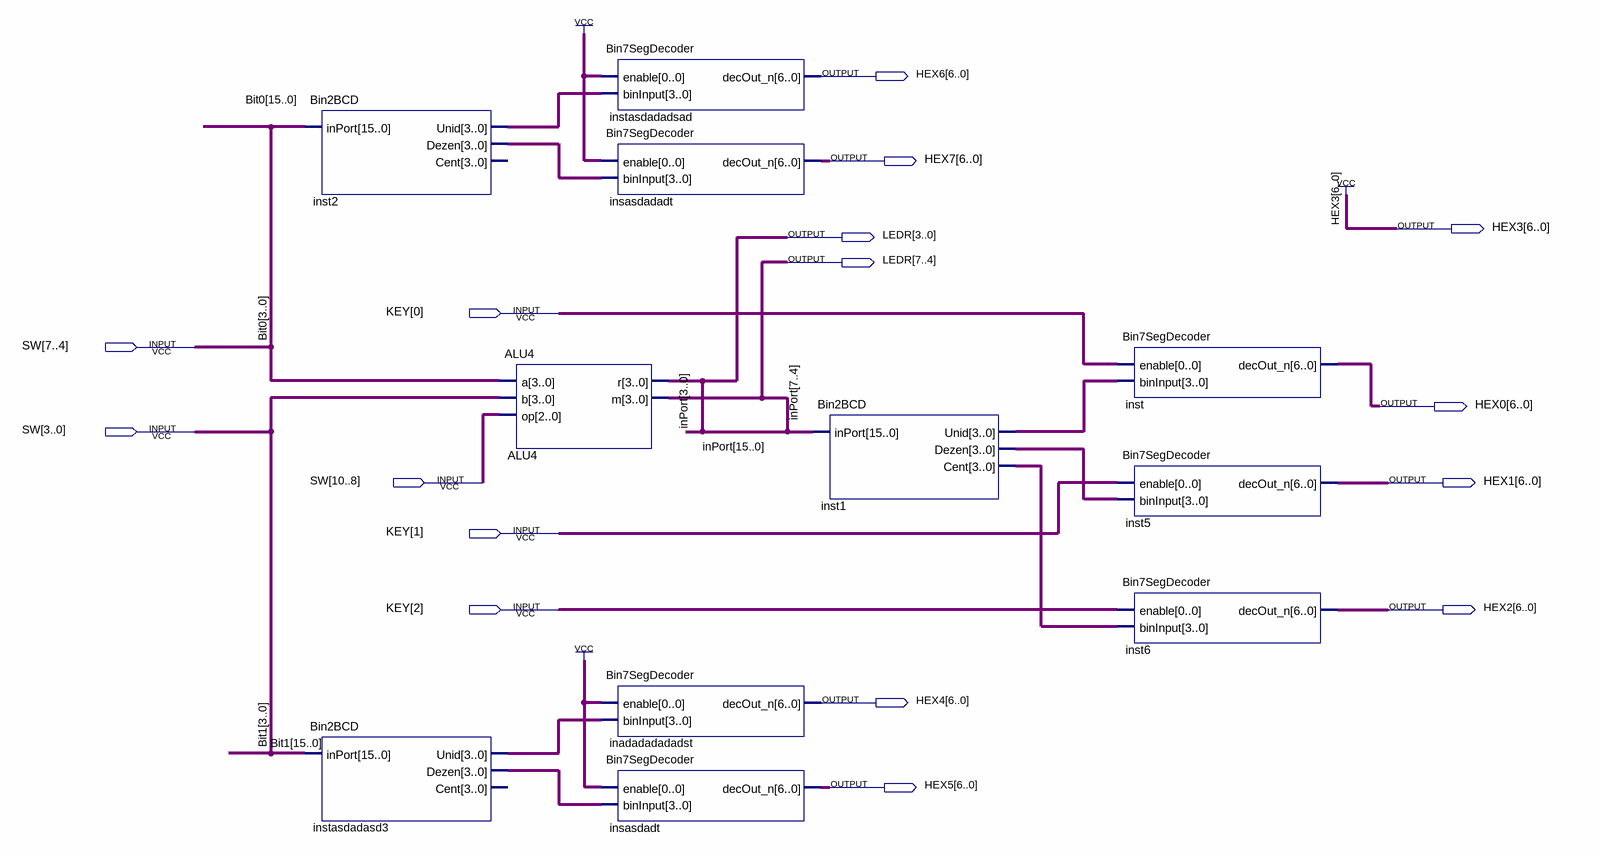
[diagram p0: schematic sheet]
// Quartus schematic ALUDemo.bdf as structural Verilog: 11 symbols, 16 pins
module ALUDemo (
  input  [2:0] KEY,
  input  [10:0] SW,
  output [6:0] HEX6,
  output [6:0] HEX7,
  output [6:0] HEX3,
  output [7:0] LEDR,
  output [6:0] HEX0,
  output [6:0] HEX1,
  output [6:0] HEX2,
  output [6:0] HEX4,
  output [6:0] HEX5
);

  wire [3:0] inst1_cent, inst1_dezen, inst1_unid, inst2_dezen, inst2_unid, instasdadasd3_dezen,
       instasdadasd3_unid;
  wire [15:4] Bit0, Bit1;
  wire [15:8] inPort;

  Bin2BCD inst2 (.inPort({Bit0, SW[7:4]}), .Unid(inst2_unid), .Dezen(inst2_dezen));  // open: Cent
  Bin2BCD instasdadasd3 (
    .inPort({Bit1, SW[3:0]}), .Unid(instasdadasd3_unid), .Dezen(instasdadasd3_dezen));  // open: Cent
  ALU4 ALU4 (.a(SW[7:4]), .b(SW[3:0]), .op(SW[10:8]), .r(LEDR[3:0]), .m(LEDR[7:4]));
  Bin7SegDecoder instasdadadsad (.enable(1'b1), .binInput(inst2_unid), .decOut_n(HEX6));
  Bin7SegDecoder insasdadadt (.enable(1'b1), .binInput(inst2_dezen), .decOut_n(HEX7));
  Bin7SegDecoder inadadadadadst (.enable(1'b1), .binInput(instasdadasd3_unid), .decOut_n(HEX4));
  Bin7SegDecoder insasdadt (.enable(1'b1), .binInput(instasdadasd3_dezen), .decOut_n(HEX5));
  Bin2BCD inst1 (.inPort({inPort, LEDR}), .Unid(inst1_unid), .Dezen(inst1_dezen), .Cent(inst1_cent));
  Bin7SegDecoder inst (.enable(KEY[0]), .binInput(inst1_unid), .decOut_n(HEX0));
  Bin7SegDecoder inst5 (.enable(KEY[1]), .binInput(inst1_dezen), .decOut_n(HEX1));
  Bin7SegDecoder inst6 (.enable(KEY[2]), .binInput(inst1_cent), .decOut_n(HEX2));

  assign HEX3 = {7{1'b1}};

  // Other names for the same wires on the sheet: inPort[7:0] = LEDR; Bit1[3:0] = SW[3:0]; Bit0[3:0] = SW[7:4]
endmodule
